# EAGLE design ng-beacon-mdbt42-conn (EAGLE 7.6.0)
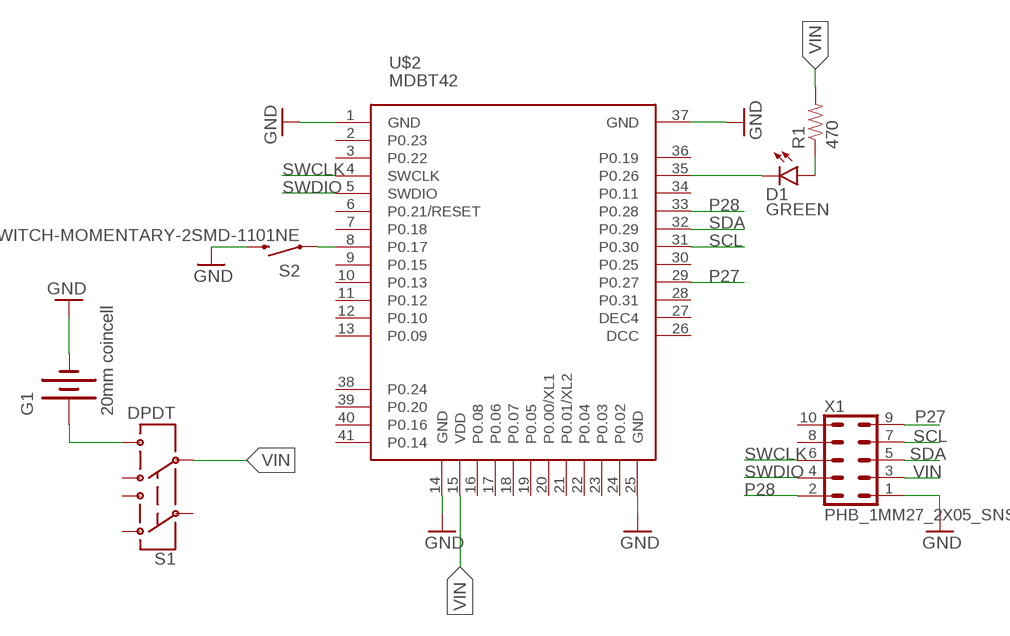
[diagram p0: schematic, sheet 1]

## Parts
D1  GREEN  LED-GREEN0603  [LED-0603]
G1  20mm coincell  BATTERY20MM_4LEGS  [BATTCON_20MM_4LEGS]
R1  470  470OHM1/10W1%(0603)  [0603-RES]
S1  DPDT  SWITCH-DPDTAYZ0202  [AYZ0202]
S2  SWITCH-MOMENTARY-2SMD-1101NE  [TACTILE-SWITCH-1101NE]
U$2  MDBT42  [MDBT42]
X1  PHB_1MM27_2X05_SNS  [PHB_1MM27_2X05_SNS]

## Nets
GND: G1.NEGATIVE(-) S2.2 U$2.1(GND) U$2.14(GND) U$2.25(GND) U$2.37(GND) X1.1
N$1: G1.POSITIVE@1(+) G1.POSITIVE@2(+) G1.POSITIVE@3(+) G1.POSITIVE@4(+) S1.6
N$4: S2.1 U$2.8(P0.17)
N$7: D1.C U$2.35(P0.26)
N$8: D1.A R1.1
P27: U$2.29(P0.27) X1.9
P28: U$2.33(P0.28) X1.2
SCL: U$2.31(P0.30) X1.7
SDA: U$2.32(P0.29) X1.5
SWCLK: U$2.4(SWCLK) X1.6
SWDIO: U$2.5(SWDIO) X1.4
VIN: R1.2 S1.5 U$2.15(VDD) X1.3
Unconnected: S1.1 S1.2 S1.3 S1.4 U$2.2(P0.23) U$2.3(P0.22) U$2.6(P0.21/RESET) U$2.7(P0.18) U$2.9(P0.15) U$2.10(P0.13) U$2.11(P0.12) U$2.12(P0.10) U$2.13(P0.09) U$2.16(P0.08) U$2.17(P0.06) U$2.18(P0.07) U$2.19(P0.05) U$2.20(P0.00/XL1) U$2.21(P0.01/XL2) U$2.22(P0.04) U$2.23(P0.03) U$2.24(P0.02) U$2.26(DCC) U$2.27(DEC4) U$2.28(P0.31) U$2.30(P0.25) U$2.34(P0.11) U$2.36(P0.19) U$2.38(P0.24) U$2.39(P0.20) U$2.40(P0.16) U$2.41(P0.14) X1.8 X1.10

## Library data of the parts
D1 = SparkFun-LED:LED-GREEN: Various green LEDs Green LEDs used in SFE Production 0603- DIO-00821 LARGE- DIO-00862 LILYPAD- DIO-09910; PROD_ID: DIO-00821
G1 = ng-beacon:BATTERY: Battery Holders Various common sizes : AA, AAA, 18650 (PRT-12895), 20mm coin cell and 12mm coin cell. 20MM_4LEGS, BATT-10373; PROD_ID: BATT-10373
R1 = SparkFun-Resistors:470OHM1/10W1%(0603): RES-07869; PROD_ID: RES-07869
S1 = ng-beacon:SWITCH-DPDT: DPDT Version of the COM-00597; PROD_ID: SWCH-08179
S2 = SparkFun-Electromechanical:SWITCH-MOMENTARY-2: Various NO switches- pushbuttons, reed, etc; PROD_ID: SWCH-00815
U$2 = MDBT42:MDBT42: Raytac Corporation MDBT42-512K, MDBT42-P512K Bluetooth Low Energy Module based on Noridc nRF52832 Source: Raytac datasheet
X1 = con_pinhead_box_1mm27:PHB_1MM27_2X05_*: Pin Header Box-Type, 1.27mm/0.5"/50mil Pitch, 2x05 Circuits Note: see library description for an important note about THT-version

## Board
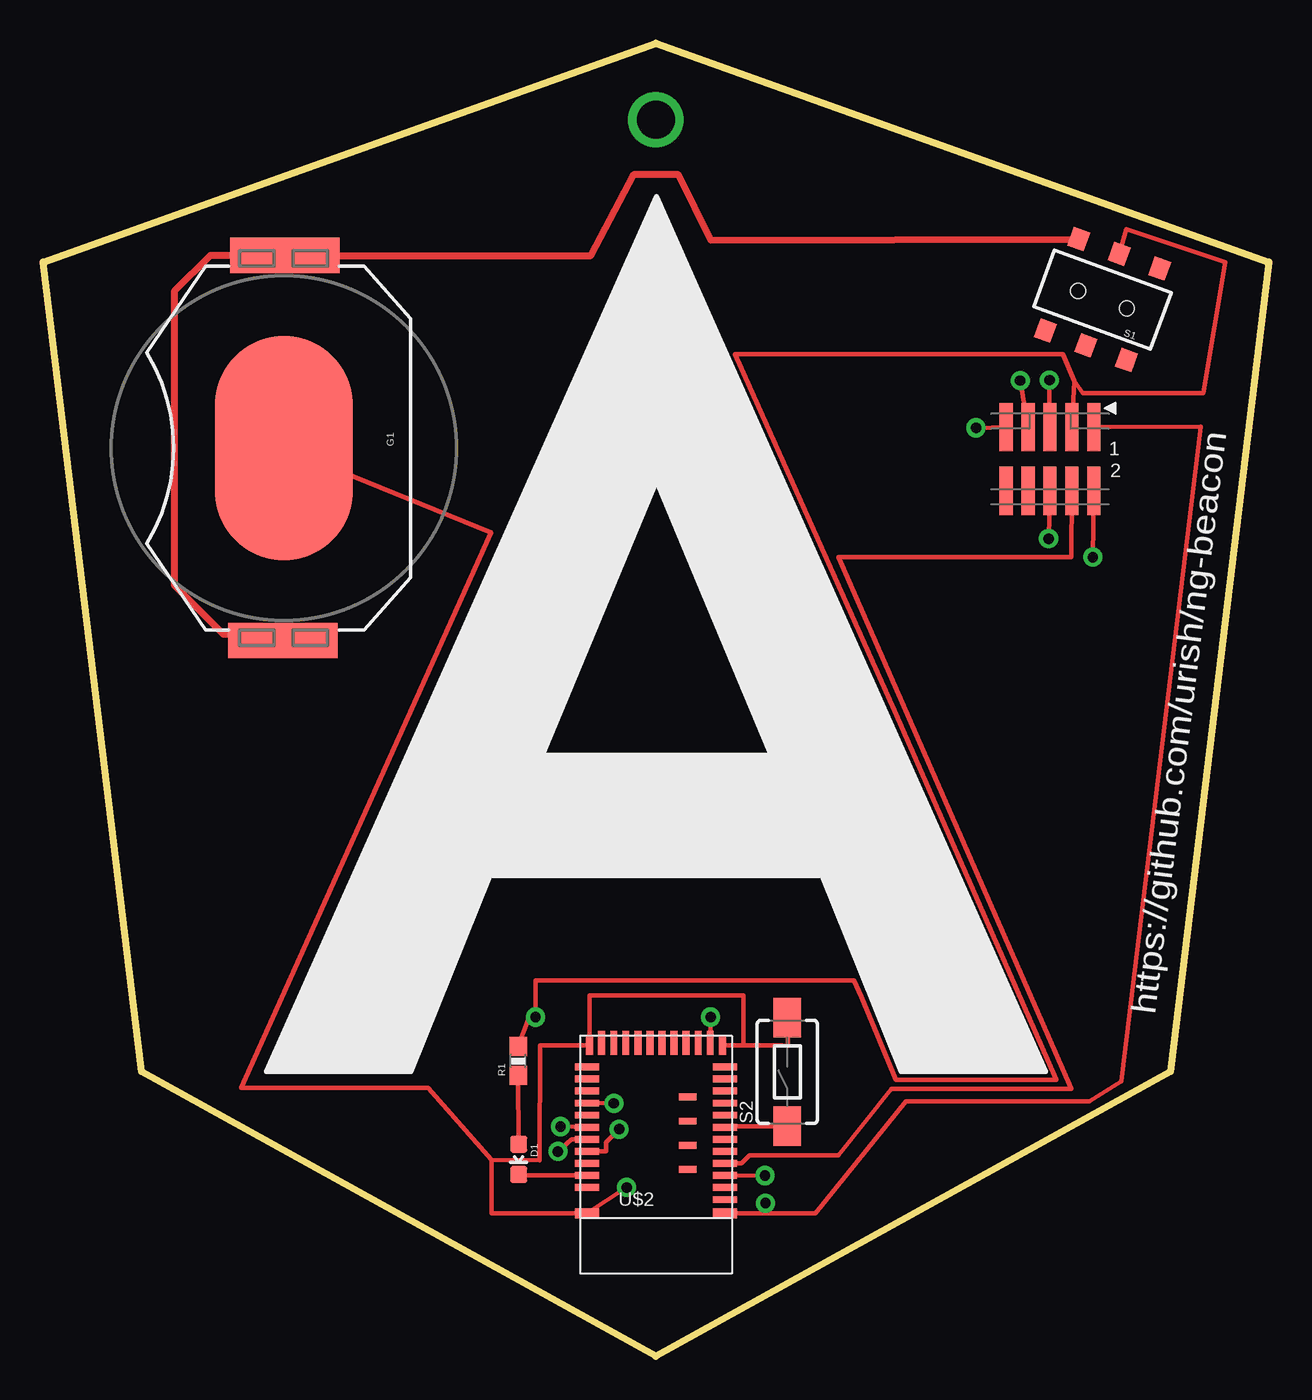
[diagram p1: board, top side]
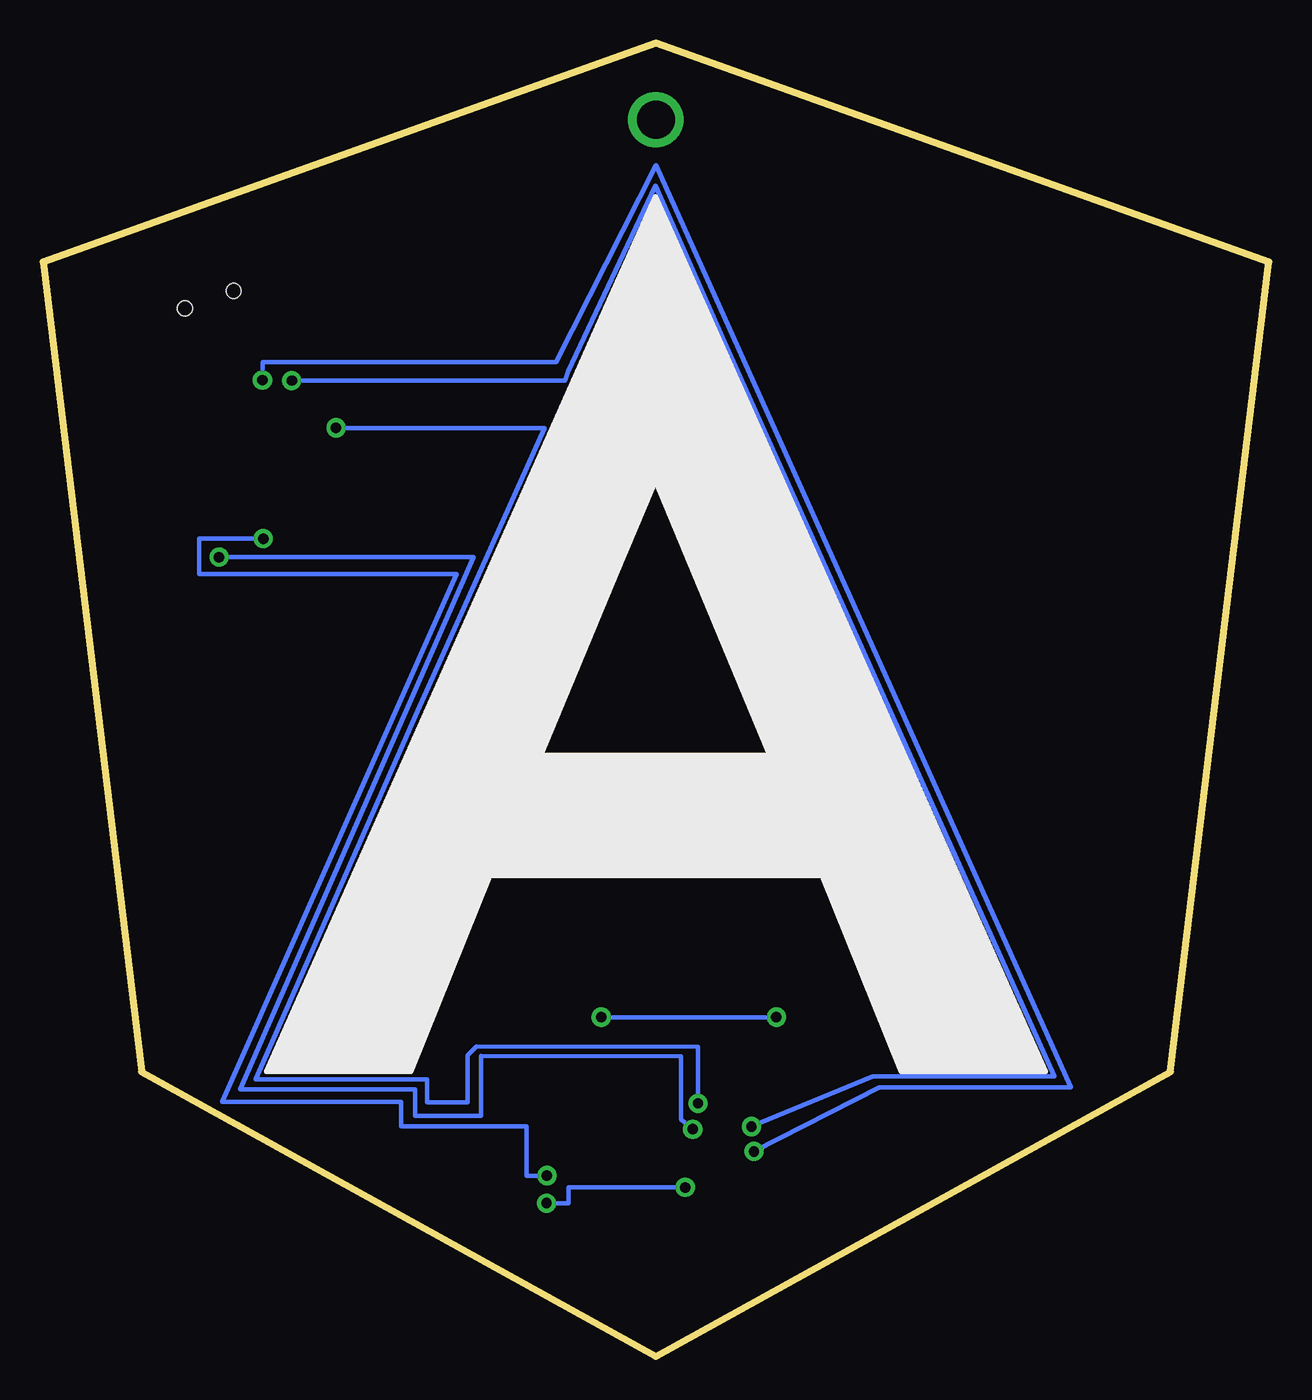
[diagram p2: board, bottom side, seen from below]

Size 71.12 x 76.2 mm. Coordinates in mm from the lower left corner, seen from the top.
Outline: 0,63.5 35.56,76.2 71.12,63.5 65.41,16.51 35.56,0 5.71,16.51 0,63.5
Copper layers (1*16): Top 0.035mm / dielectric 1.5mm / Bottom 0.035mm
Design rules "SparkFun-2-layer-STANDARD *": minimum track width 10mil, minimum drill 20mil, track to track 10mil, track to pad 8mil, pad to pad 8mil, via to via 10mil, smd to smd 8mil, copper to edge 8mil, drill to drill 8mil, minimum pad ring 10mil, minimum via ring 10mil, stop-mask expansion 4mil, vias tented up to drill 25mil, thermal gap 10mil

### Footprints (pad centres in the part's own frame; a part is rotated, then mirrored left to right if it is on the bottom)
LED-0603 = smd 1 x 1: A 0,-0.877; C 0,0.877
BATTCON_20MM_4LEGS = smd 13 x 8: NEGATIVE 0,0 | smd 2.032 x 3.175: POSITIVE@1 -11.176,1.651; POSITIVE@2 -11.176,-1.524; POSITIVE@3 11.176,1.524; POSITIVE@4 11.176,-1.651
0603-RES = smd 1.1 x 1: 1 -0.85,0; 2 0.85,0
AYZ0202 = smd 1 x 1.15: 1 -2.5,2.825; 2 0,2.825; 3 2.5,2.825; 4 -2.5,-2.825; 5 0,-2.825; 6 2.5,-2.825 | hole 0.85: 1.5,0; -1.5,0
TACTILE-SWITCH-1101NE = smd 2.3 x 1.6: 1 -3.15,0; 2 3.15,0
MDBT42 = smd 1.4 x 0.6: 1 -4,4.4; 37 4,4.4 | smd 1.4 x 0.4: 2 -4,3.6; 3 -4,2.9; 4 -4,2.2; 5 -4,1.5; 6 -4,0.8; 7 -4,0.1; 8 -4,-0.6; 9 -4,-1.3; 10 -4,-2; 11 -4,-2.7; 12 -4,-3.4; 13 -4,-4.1; 26 4,-4.1; 27 4,-3.4; 28 4,-2.7; 29 4,-2; 30 4,-1.3; 31 4,-0.6; 32 4,0.1; 33 4,0.8; 34 4,1.5; 35 4,2.2; 36 4,2.9 | smd 0.4 x 1.1: 14 -3.85,-5.35; 25 3.85,-5.35 | smd 0.4 x 1.4: 15 -3.15,-5.5; 16 -2.45,-5.5; 17 -1.75,-5.5; 18 -1.05,-5.5; 19 -0.35,-5.5; 20 0.35,-5.5; 21 1.05,-5.5; 22 1.75,-5.5; 23 2.45,-5.5; 24 3.15,-5.5 | smd 1 x 0.4: 38 -1.85,1.85; 39 -1.85,0.45; 40 -1.85,-0.95; 41 -1.85,-2.35
PHB_1MM27_2X05_SNS = smd 0.76 x 2.8: 1 -2.54,-1.85; 2 -2.54,1.85; 3 -1.27,-1.85; 4 -1.27,1.85; 5 0,-1.85; 6 0,1.85; 7 1.27,-1.85; 8 1.27,1.85; 9 2.54,-1.85; 10 2.54,1.85

### Placement (x,y rotation side)
D1  27.6,11.43 180 top
G1  13.97,52.71 270 top
R1  27.57,17.14 90 top
S1  61.47,61.32 160 top
S2  43.18,16.51 90 top
U$2  35.56,12.7 180 top
X1  58.42,52.07 180 top

### Tracks (layer width: path | path; a pad name or v marks a point on that pad's centre or on a via)
GND  (via drill 0.6)
  Top 0.254: 40.64,18.05 42.91,18.05 43.23,18.01 S2.2 | 40.64,18.05 U$2.14 39.37,18.09 | 40.64,18.05 40.64,20.95 31.71,20.95 U$2.25 28.83,18.06 28.8,11.38 26.04,11.4 | 39.56,8.26 U$2.1 41.91,8.3 | 31.51,8.26 U$2.37 | U$2.37 26.04,8.3 26.04,11.4 | 41.91,8.3 44.81,8.31 50.06,14.81 60.71,14.81 62.56,15.95 67.18,53.95 X1.1 | G1.NEGATIVE 25.98,47.8 11.51,15.6 22.33,15.57 26.04,11.4 | U$2.37 v33.86,9.8 | v41.91,8.89 41.91,8.3
  Bottom 0.254: v33.86,9.8 40.64,9.8 40.64,8.89 v41.91,8.89
N$1
  Top 0.254: G1.POSITIVE@2 16.51,63.88
  Top 0.406: S1.6 38.73,64.77 36.83,68.58 34.29,68.58 31.79,63.88 16.51,63.88 G1.POSITIVE@1 G1.POSITIVE@2 9.7,63.88 7.62,61.8 7.62,44.75 10.46,41.91 12.07,41.91 12.07,41.28 12.7,41.28 | 12.7,41.28 12.7,41.91 12.32,41.91 G1.POSITIVE@4 | 12.7,41.28 15.49,41.28 G1.POSITIVE@3
N$3  (via drill 2.2)
  other vias: 35.56,71.75
N$4
  Top 0.254: S2.1 43.18,13.33 39.59,13.33 U$2.8
N$7
  Top 0.254: U$2.35 27.5,10.5 D1.C
N$8
  Top 0.254: R1.1 D1.A
P27  (via drill 0.6)
  Top 0.254: U$2.29 v33.12,14.68 | X1.9 v54.13,53.87
  Bottom 0.254: v33.12,14.68 33.12,17.96 45.98,17.98 46.48,17.45 46.48,14.73 48.84,14.73 48.84,16.08 58.8,16.08 49.4,37.44 42.04,53.87 v54.13,53.87
P28  (via drill 0.6)
  Top 0.254: v33.43,13.18 32.66,12.42 32.66,11.91 32.65,11.9 U$2.33 | X1.2 v60.91,46.37
  Bottom 0.254: v33.43,13.18 34.11,13.74 34.11,17.4 45.72,17.42 45.72,13.97 49.54,13.97 49.54,15.49 59.69,15.49 46.14,46.37 v60.91,46.37
SCL  (via drill 0.6)
  Top 0.254: U$2.31 v30.02,13.33 | v56.69,56.62 X1.7
  Bottom 0.254: v30.02,13.33 22.96,16.26 12.45,16.26 31.57,58.85 35.58,67.92 40.67,57.15 40.84,56.62 v56.69,56.62
SDA  (via drill 0.6)
  Top 0.254: X1.5 v58.4,56.64 | U$2.32 30.66,12.6 v29.87,11.89
  Bottom 0.254: v58.4,56.64 58.37,57.68 41.35,57.68 35.56,69.11 11.48,15.62 22.61,15.62 v29.87,11.89
SWCLK  (via drill 0.6)
  Top 0.254: v58.34,47.45 X1.6 | U$2.4 v41.89,10.49
  Bottom 0.254: v41.89,10.49 43.08,10.49 43.08,13.36 50.34,13.36 50.34,14.78 60.73,14.78 47.14,45.39 62.07,45.39 62.07,47.45 v58.34,47.45
SWDIO
  Top 0.254: U$2.5 40.51,11.2 41,11.66 46.15,11.66 49.22,15.52 59.67,15.52 46.14,46.37 59.67,46.37 X1.4
VIN  (via drill 0.6)
  Top 0.254: U$2.15 v38.73,19.68 | R1.2 28.21,19.68 v28.57,19.68 28.57,21.82 47.04,21.82 47.47,20.87 49.48,16.05 58.8,16.05 49.4,37.49 40.16,58.17 59.18,58.17 59.84,56.6 | S1.5 62.87,65.41 68.58,63.5 67.31,55.88 60.33,55.88 59.84,56.6 | X1.3 59.84,56.6
  Bottom 0.254: v38.73,19.68 v28.57,19.68

### Text on the board
tNames: https://github.com/urish/ng-beacon